# EasyEDA Pro project 指纹模块固定板.epro

# Board PCB4
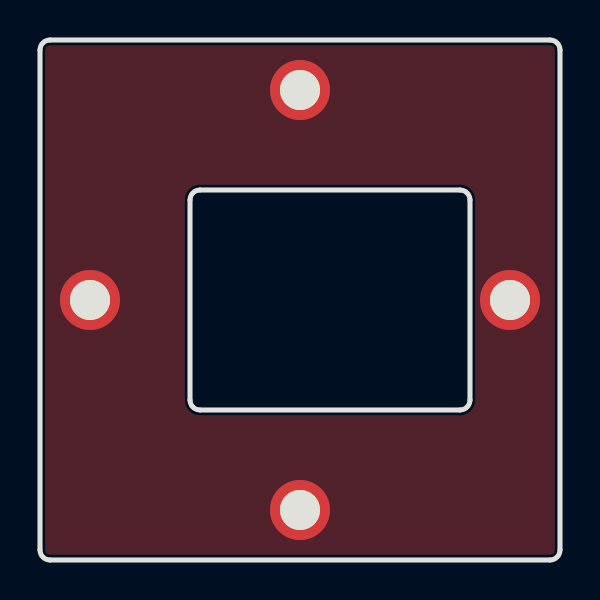
[diagram p0: board, top side]
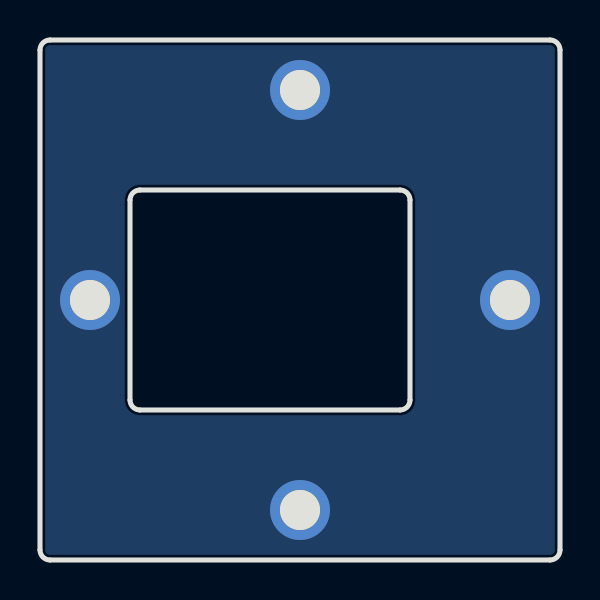
[diagram p1: board, bottom side, seen from below]

Outline 26 x 26 mm; copper layers: Top Layer, Bottom Layer. Coordinates in mm from the lower left corner of the outline.
Outline path: 0,25.5 0,0.5 arc(0.15,0.15) 0.5,0 25.5,0 arc(25.85,0.15) 26,0.5 26,25.5 arc(25.85,25.85) 25.5,26 0.5,26 arc(0.15,25.85) 0,25.5 ; 7.5,18 7.5,8 arc(7.65,7.65) 8,7.5 21,7.5 arc(21.35,7.65) 21.5,8 21.5,18 arc(21.35,18.35) 21,18.5 8,18.5 arc(7.65,18.35) 7.5,18
Stack: Top Layer 0.035mm / Dielectric1 0.91mm FR4 er 4.5 / Bottom Layer 0.035mm

## Design rules (mm)
spacing copperThickness1oz (default): track to track 0.102, other pairs 0.152 to 0.3
spacing copperThickness2oz: track to track 0.203, other pairs 0.152 to 0.3
track width copperThickness1oz (default): min 0.127, default 0.254, max 2.54
track width copperThickness2oz: min 0.203, default 0.254, max 2.54
differential pair differentialPair (default): width min 0.127, default 0.254, max 2.54; gap min 0.152, default 0.152
net GND uses copperRegion

## Placement (name value [footprint] x y rotation side)
NOREF  -  [Pad_e10]  13 23.5 90 top
NOREF#2  -  [Pad_e5]  13 2.5 90 top
NOREF#3  -  [Pad_e4]  23.5 13 0 top
NOREF#4  -  [Pad_e3]  2.5 13 0 top

## Footprints (pads in the part's own frame, mm; a bottom-side part is the same pattern mirrored in y, then rotated)
Pad_e3
  round 3 hole 2: 1(0,0)
Pad_e4
  round 3 hole 2: 1(0,0)
Pad_e5
  round 3 hole 2: 1(0,0)
Pad_e10
  round 3 hole 2: 1(0,0)

## Nets
GND: NOREF.1 NOREF#2.1 NOREF#3.1 NOREF#4.1

## Copper pours and planes (outline as drawn; the poured copper is in the pictures)
GND on Top Layer: -0.01,26.01 26.89,26.01 26.89,-0.22 -0.01,-0.22
GND on Bottom Layer: -0.01,26.01 26.89,26.01 26.89,-0.22 -0.01,-0.22
